# EAGLE design gps_tracker (EAGLE 7.4.0)

## Sheet 1 of 2
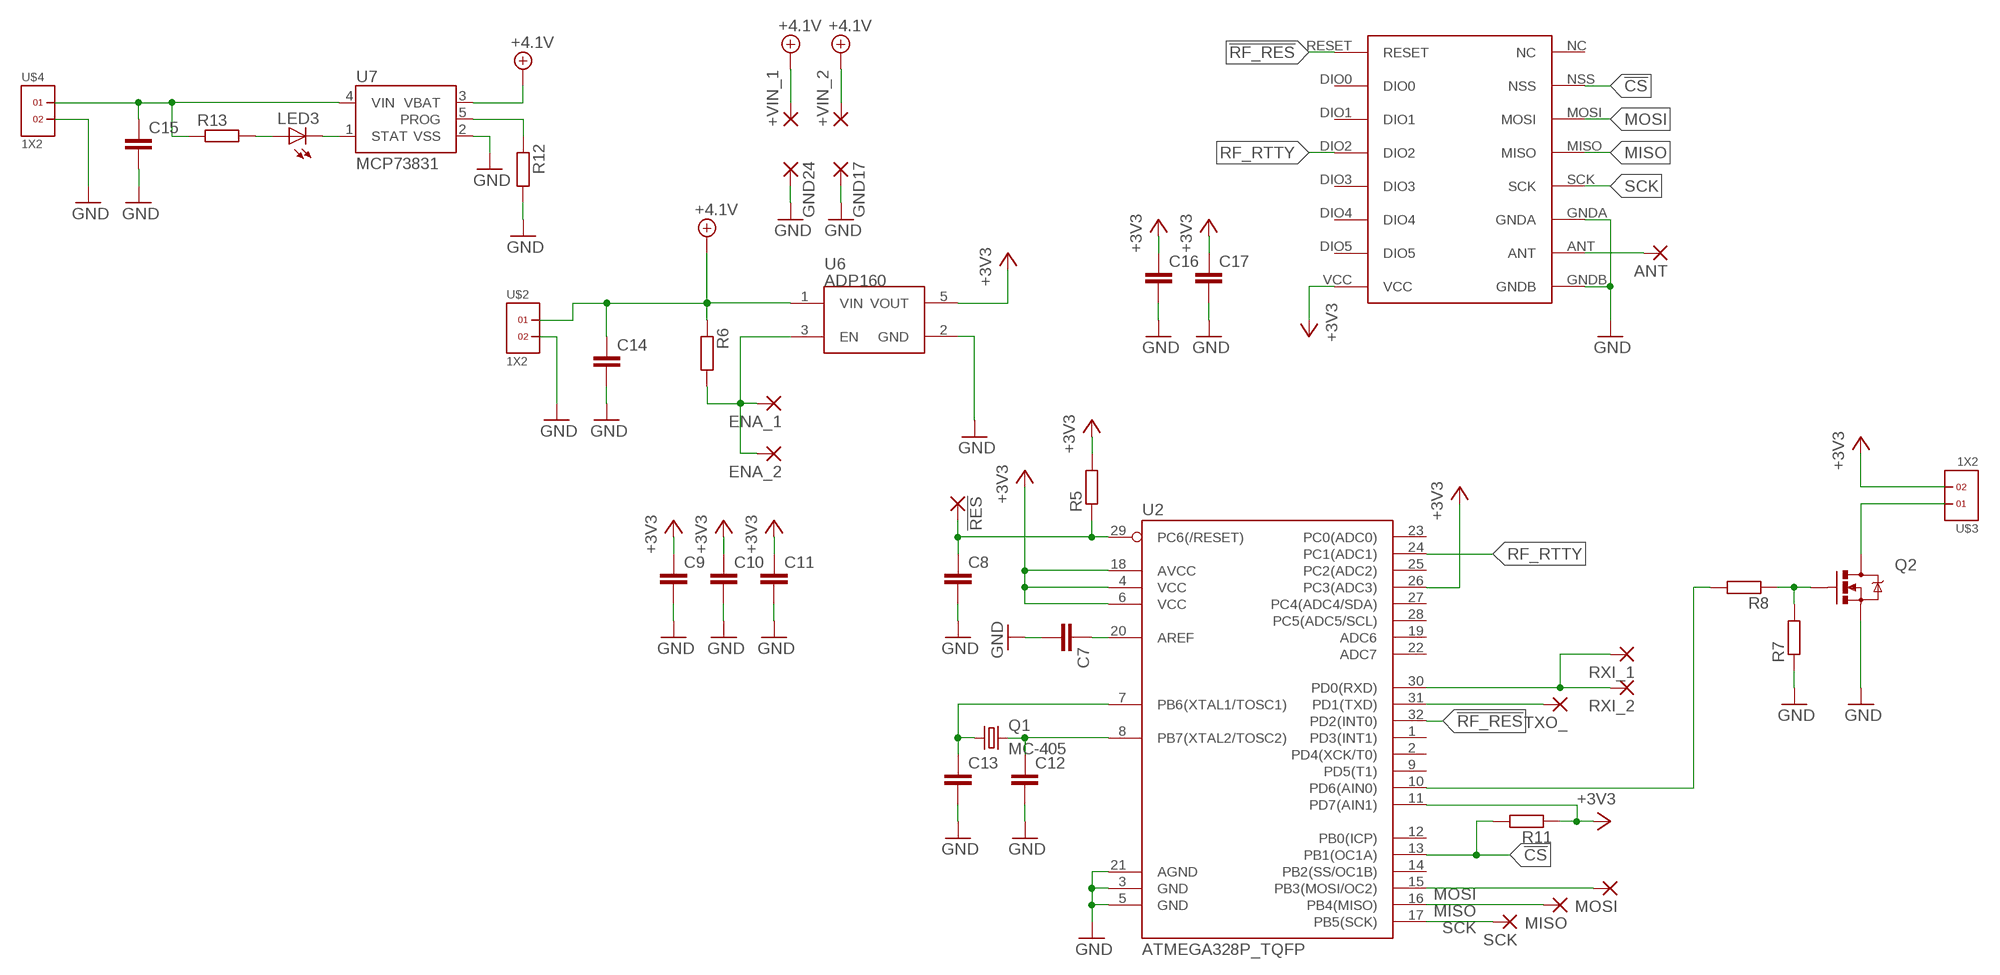
[diagram p0: schematic, sheet 1, part 1 of 2]
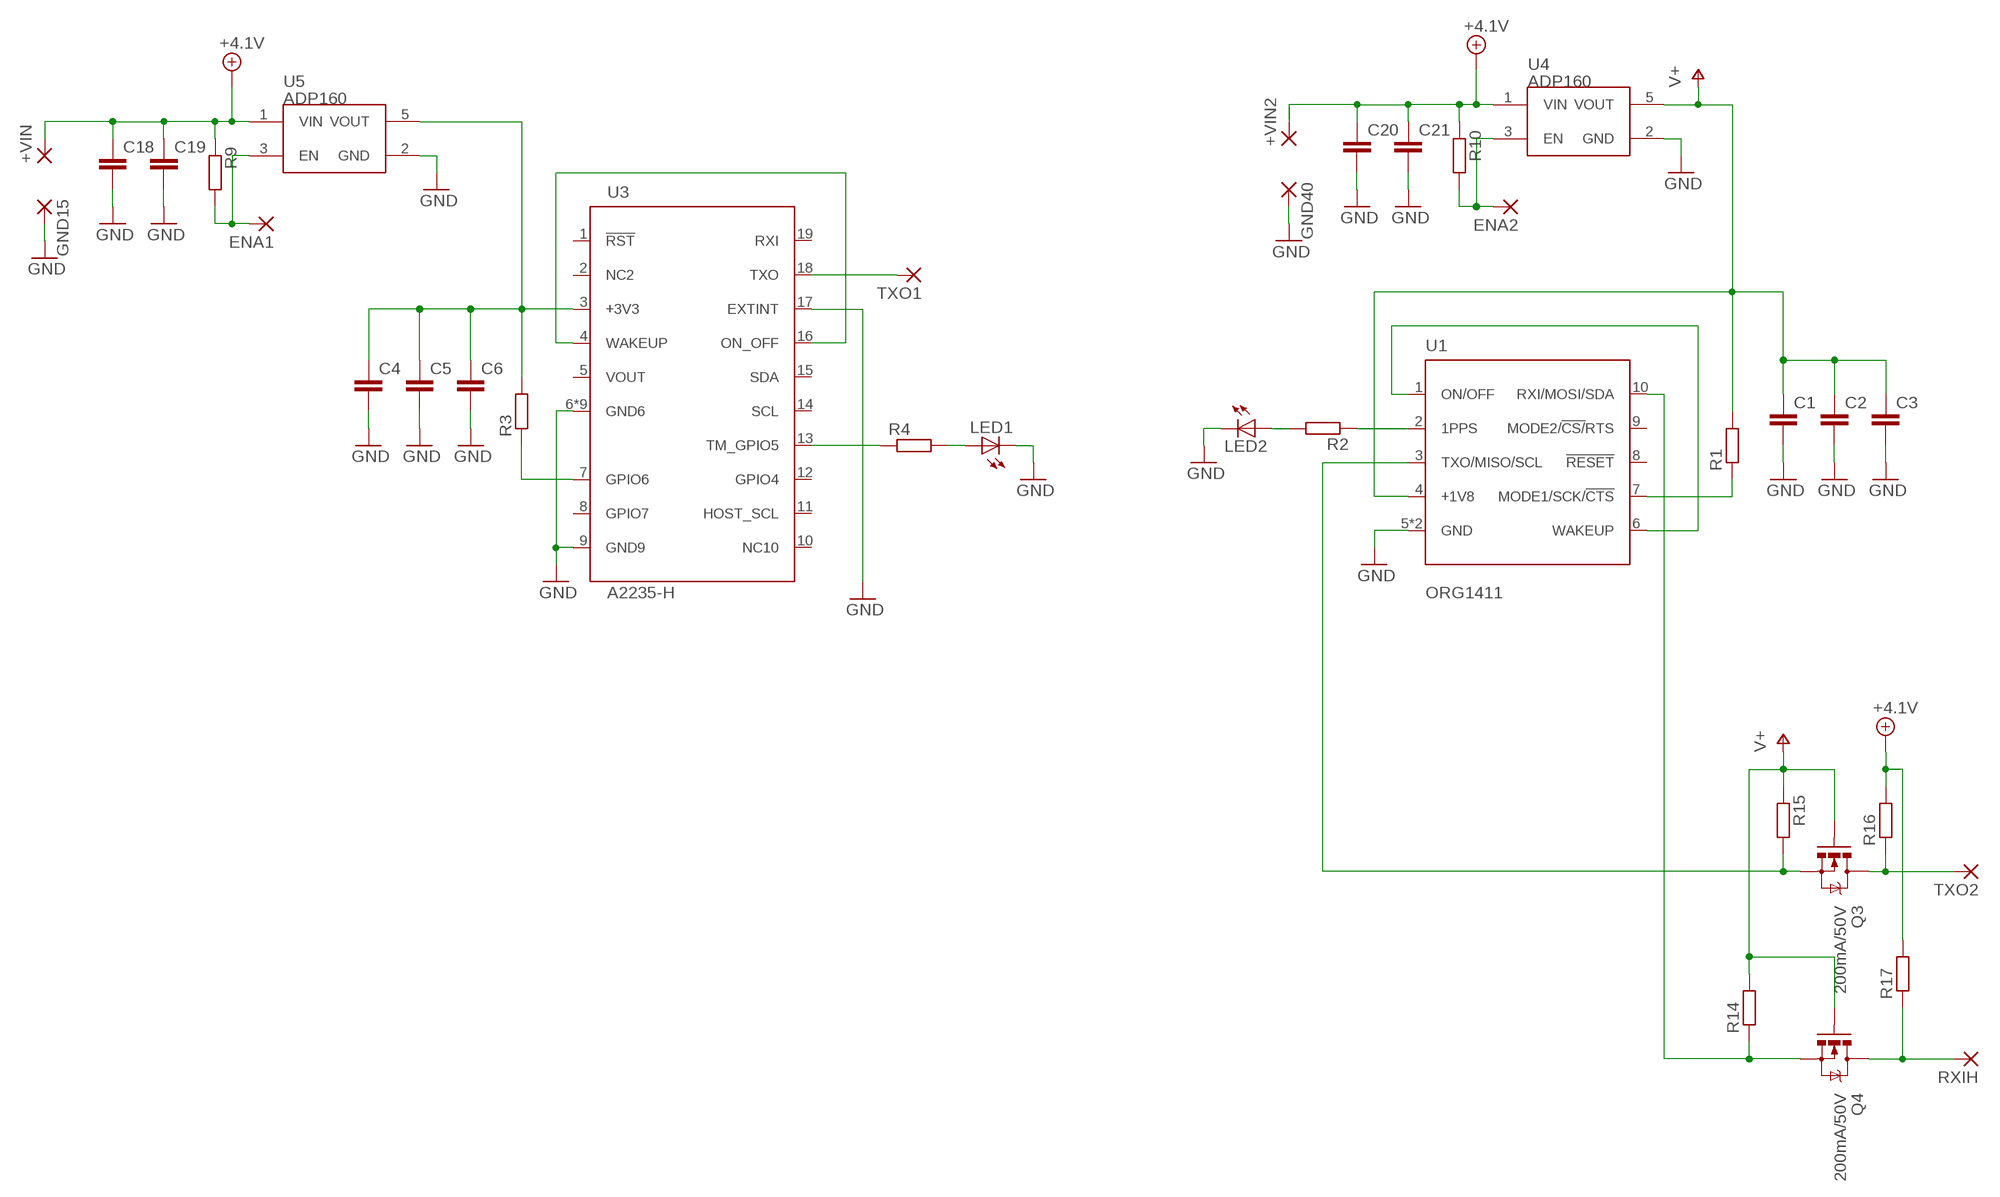
[diagram p1: schematic, sheet 1, part 2 of 2]

### Parts
!RES  SMD2  [SMD1,27-2,54]
+VIN  SMD2  [SMD1,27-2,54]
+VIN2  SMD2  [SMD1,27-2,54]
+VIN_1  SMD2  [SMD1,27-2,54]
+VIN_2  SMD2  [SMD1,27-2,54]
ANT  SMD2  [SMD1,27-2,54]
C1  C-EUC0603  [C0603]
C2  C-EUC0603  [C0603]
C3  C-EUC0603  [C0603]
C4  C-EUC0603  [C0603]
C5  C-EUC0603  [C0603]
C6  C-EUC0603  [C0603]
C7  C-EUC0603  [C0603]
C8  C-EUC0603  [C0603]
C9  C-EUC0603  [C0603]
C10  C-EUC0603  [C0603]
C11  C-EUC0603  [C0603]
C12  C-EUC0603  [C0603]
C13  C-EUC0603  [C0603]
C14  C-EUC0603  [C0603]
C15  C-EUC0603  [C0603]
C16  C-EUC0603  [C0603]
C17  C-EUC0603  [C0603]
C18  C-EUC0603  [C0603]
C19  C-EUC0603  [C0603]
C20  C-EUC0603  [C0603]
C21  C-EUC0603  [C0603]
ENA1  SMD2  [SMD1,27-2,54]
ENA2  SMD2  [SMD1,27-2,54]
ENA_1  SMD2  [SMD1,27-2,54]
ENA_2  SMD2  [SMD1,27-2,54]
GND15  SMD2  [SMD1,27-2,54]
GND17  SMD2  [SMD1,27-2,54]
GND24  SMD2  [SMD1,27-2,54]
GND40  SMD2  [SMD1,27-2,54]
LED1  LEDCHIPLED_0603  [CHIPLED_0603]
LED2  LEDCHIPLED_0603  [CHIPLED_0603]
LED3  LEDCHIPLED_0603  [CHIPLED_0603]
MISO  SMD2  [SMD1,27-2,54]
MOSI  SMD2  [SMD1,27-2,54]
Q1  MC-405  [MC-405]
Q2  MOSFET-NCHANNELAO3404A  [SOT23-3]
Q3  200mA/50V  MOSFET-NCHANNELBSS138  [SOT23-3]
Q4  200mA/50V  MOSFET-NCHANNELBSS138  [SOT23-3]
R1  R-EU_R0603  [R0603]
R2  R-EU_R0603  [R0603]
R3  R-EU_R0603  [R0603]
R4  R-EU_R0603  [R0603]
R5  R-EU_R0603  [R0603]
R6  R-EU_R0603  [R0603]
R7  R-EU_R0603  [R0603]
R8  R-EU_R0603  [R0603]
R9  R-EU_R0603  [R0603]
R10  R-EU_R0603  [R0603]
R11  R-EU_R0603  [R0603]
R12  R-EU_R0603  [R0603]
R13  R-EU_R0603  [R0603]
R14  R-EU_R0603  [R0603]
R15  R-EU_R0603  [R0603]
R16  R-EU_R1206  [R1206]
R17  R-EU_R1206  [R1206]
RXI_1  SMD2  [SMD1,27-2,54]
RXI_2  SMD2  [SMD1,27-2,54]
RXIH  SMD2  [SMD1,27-2,54]
SCK  SMD2  [SMD1,27-2,54]
TXO1  SMD2  [SMD1,27-2,54]
TXO2  SMD2  [SMD1,27-2,54]
TXO_  SMD2  [SMD1,27-2,54]
U1  ORG1411  [ORG1411]
U2  ATMEGA328P_TQFP  [TQFP32-08]
U3  A2235-H  [A2235-H]
U4  ADP160  [SOT23-5]
U5  ADP160  [SOT23-5]
U6  ADP160  [SOT23-5]
U7  MCP73831  [SOT23-5]
U$1  RFM69HW  [RFM]
U$2  1X2  [1X2]
U$3  1X2  [1X2]
U$4  1X2  [1X2]

### Nets
!CS: R11.2 U2.13(PB1(OC1A)) U$1.NSS
!RF_RES: U2.32(PD2(INT0)) U$1.RESET
+3V3: C9.1 C10.1 C11.1 C16.1 C17.1 R5.2 R11.1 U2.4(VCC) U2.6(VCC) U2.11(PD7(AIN1)) U2.18(AVCC) U2.26(PC3(ADC3)) U6.5(VOUT) U$1.VCC U$3.2
+4.1V: +VIN2.1(P) +VIN.1(P) +VIN_1.1(P) +VIN_2.1(P) C14.1 C18.1 C19.1 C20.1 C21.1 R6.1 R9.1 R10.1 R16.2 R17.2 U4.1(VIN) U5.1(VIN) U6.1(VIN) U7.3(VBAT) U$2.1
ENA: ENA_1.1(P) ENA_2.1(P) R6.2 U6.3(EN)
GND: C1.2 C2.2 C3.2 C4.2 C5.2 C6.2 C7.2 C8.2 C9.2 C10.2 C11.2 C12.2 C13.2 C14.2 C15.2 C16.2 C17.2 C18.2 C19.2 C20.2 C21.2 GND15.1(P) GND17.1(P) GND24.1(P) GND40.1(P) LED1.C LED2.C Q2.2(S) R7.1 R12.2 U1.5(GND) U1.11(GND) U2.3(GND) U2.5(GND) U2.21(AGND) U3.6(GND6) U3.9(GND9) U3.17(EXTINT) U3.101(GND6) U3.102(GND6) U3.103(GND6) U3.104(GND6) U3.105(GND6) U3.106(GND6) U3.107(GND6) U3.108(GND6) U4.2(GND) U5.2(GND) U6.2(GND) U7.2(VSS) U$1.GNDA U$1.GNDB U$2.2 U$4.2 ; also sheet 2
MISO: MISO.1(P) U2.16(PB4(MISO)) U$1.MISO
MOSI: MOSI.1(P) U2.15(PB3(MOSI/OC2)) U$1.MOSI
N$1: U1.1(ON/OFF) U1.6(WAKEUP)
N$2: R1.1 U1.7(MODE1/SCK/!CTS)
N$3: R2.1 U1.2(1PPS)
N$4: LED2.A R2.2
N$5: Q3.2(S) R15.2 U1.3(TXO/MISO/SCL)
N$6: R3.1 U3.7(GPIO6)
N$7: LED1.A R4.2
N$8: R4.1 U3.13(TM_GPIO5)
N$9: U3.4(WAKEUP) U3.16(ON_OFF)
N$10: TXO1.1(P) U3.18(TXO)
N$11: R12.1 U7.5(PROG)
N$12: C7.1 U2.20(AREF)
N$13: !RES.1(P) C8.1 R5.1 U2.29(PC6(/RESET))
N$14: ANT.1(P) U$1.ANT
N$15: C12.1 Q1.2 U2.8(PB7(XTAL2/TOSC2))
N$16: C13.1 Q1.1 U2.7(PB6(XTAL1/TOSC1))
N$17: TXO_.1(P) U2.31(PD1(TXD))
N$18: LED3.C U7.1(STAT)
N$19: Q2.1(G) R7.2 R8.1
N$20: R8.2 U2.10(PD6(AIN0))
N$21: Q2.3(D) U$3.1
N$22: LED3.A R13.2
N$23: ENA1.1(P) R9.2 U5.3(EN)
N$24: C15.1 R13.1 U7.4(VIN) U$4.1
N$25: ENA2.1(P) R10.2 U4.3(EN)
N$26: Q3.3(D) R16.1 TXO2.1(P)
N$27: C4.1 C5.1 C6.1 R3.2 U3.3(+3V3) U5.5(VOUT)
N$30: Q4.3(D) R17.1 RXIH.1(P)
N$32: Q4.2(S) R14.1 U1.10(RXI/MOSI/SDA)
RF_RTTY: U2.24(PC1(ADC1)) U$1.DIO2
RXI: RXI_1.1(P) RXI_2.1(P) U2.30(PD0(RXD))
SCK: SCK.1(P) U2.17(PB5(SCK)) U$1.SCK
V+: C1.1 C2.1 C3.1 Q3.1(G) Q4.1(G) R1.2 R14.2 R15.1 U1.4(+1V8) U4.5(VOUT)
Unconnected: U1.8(!RESET) U1.9(MODE2/!CS/!RTS) U2.1(PD3(INT1)) U2.2(PD4(XCK/T0)) U2.9(PD5(T1)) U2.12(PB0(ICP)) U2.14(PB2(SS/OC1B)) U2.19(ADC6) U2.22(ADC7) U2.23(PC0(ADC0)) U2.25(PC2(ADC2)) U2.27(PC4(ADC4/SDA)) U2.28(PC5(ADC5/SCL)) U3.1(!RST) U3.2(NC2) U3.8(GPIO7) U3.10(NC10) U3.11(HOST_SCL) U3.12(GPIO4) U3.14(SCL) U3.15(SDA) U3.19(RXI) U$1.DIO0 U$1.DIO1 U$1.DIO3 U$1.DIO4 U$1.DIO5 U$1.NC

## Sheet 2 of 2
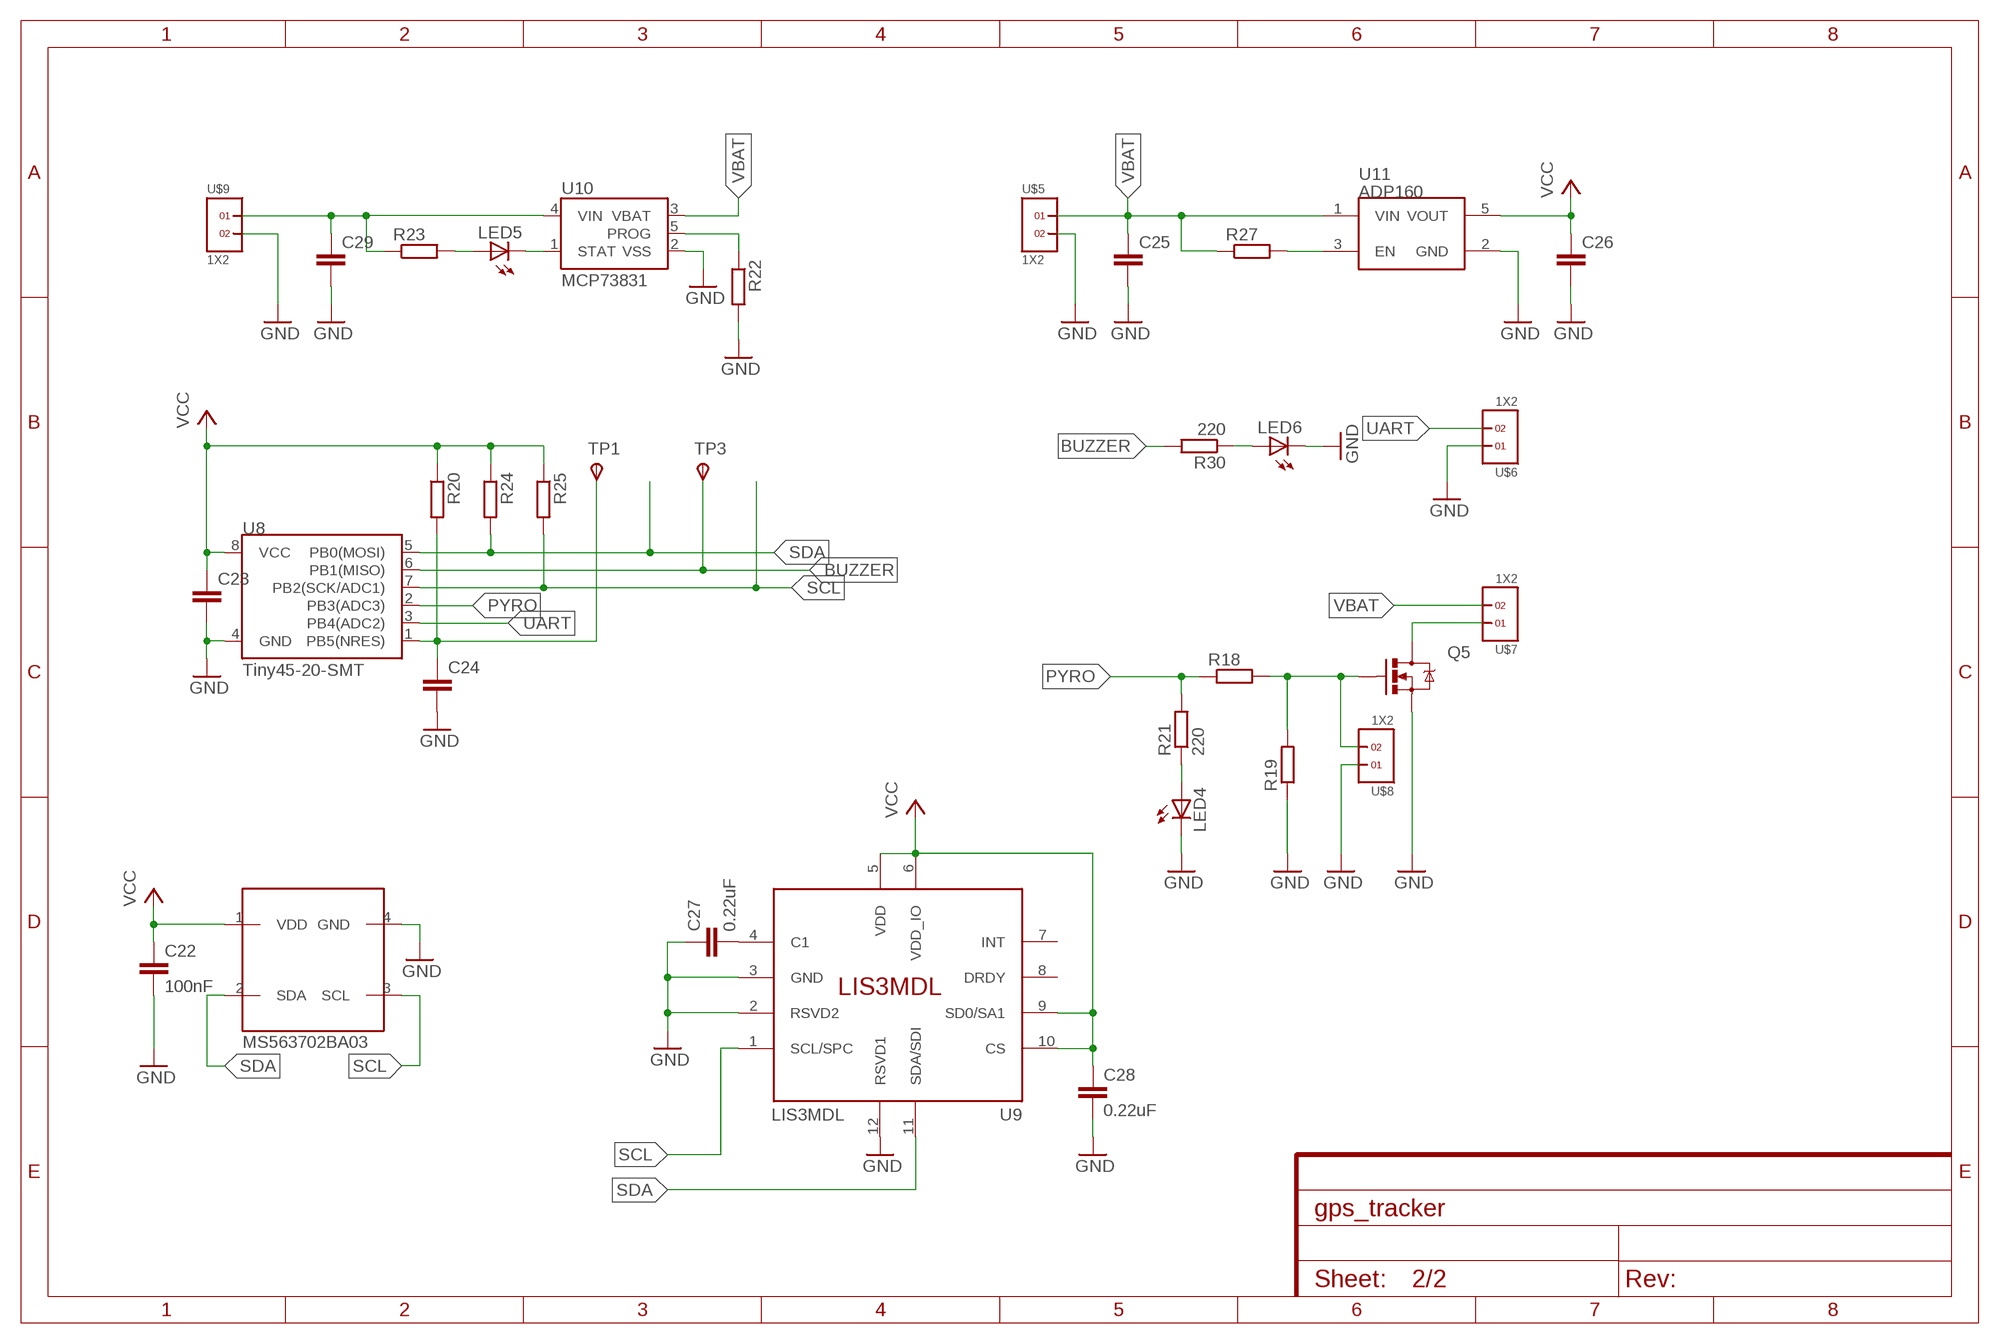
[diagram p2: schematic, sheet 2]

### Parts
C22  100nF  C-EUC0603  [C0603]
C23  C-EUC1206  [C1206]
C24  C-EUC0603  [C0603]
C25  C-EUC0603  [C0603]
C26  C-EUC0603  [C0603]
C27  0.22uF  C-EUC0603K  [C0603K]
C28  0.22uF  C-EUC0603  [C0603]
C29  C-EUC0603  [C0603]
IC1  MS563702BA03  [MS5637]
LED4  LEDCHIPLED_0805  [CHIPLED_0805]
LED5  LEDCHIPLED_0603  [CHIPLED_0603]
LED6  LEDCHIPLED_0805  [CHIPLED_0805]
Q5  MOSFET-NCHANNELBSS123LT1G  [SOT23-3]
R18  R-EU_R0603  [R0603]
R19  R-EU_R0603  [R0603]
R20  R-EU_R0603  [R0603]
R21  220  R-EU_R0603  [R0603]
R22  R-EU_R0603  [R0603]
R23  R-EU_R0603  [R0603]
R24  R-EU_R0603  [R0603]
R25  R-EU_R0603  [R0603]
R27  R-EU_R0603  [R0603]
R30  220  R-EU_R0603  [R0603]
TP1  TPSB1,27  [B1,27]
TP3  TPSB1,27  [B1,27]
U8  Tiny45-20-SMT  ATTINY45TINY45-20-SMT  [SO08-EIAJ]
U9  LIS3MDL  [VFLGA-12]
U10  MCP73831  [SOT23-5]
U11  ADP160  [SOT23-5]
U$5  1X2  [1X2]
U$6  1X2  [1X2]
U$7  1X2  [1X2]
U$8  1X2  [1X2]
U$9  1X2  [1X2]

### Nets
BUZZER: R30.2 TP3.TP(PP) U8.6(PB1(MISO))
GND: C22.2 C23.2 C24.2 C25.2 C26.2 C27.1 C28.2 C29.2 IC1.4(GND) LED4.C LED6.C Q5.2(S) R19.1 R22.2 U8.4(GND) U9.2(RSVD2) U9.3(GND) U9.12(RSVD1) U10.2(VSS) U11.2(GND) U$5.2 U$6.1 U$8.1 U$9.2 ; also sheet 1
N$28: Q5.3(D) U$7.1
N$29: C24.1 R20.2 TP1.TP(PP) U8.1(PB5(NRES))
N$31: Q5.1(G) R18.2 R19.2 U$8.2
N$33: LED4.A R21.1
N$34: R27.2 U11.3(EN)
N$35: LED6.A R30.1
N$36: C27.2 U9.4(C1)
N$37: R22.1 U10.5(PROG)
N$38: LED5.C U10.1(STAT)
N$39: LED5.A R23.2
N$40: C29.1 R23.1 U10.4(VIN) U$9.1
PYRO: R18.1 R21.2 U8.2(PB3(ADC3))
SCL: IC1.3(SCL) R25.2 U8.7(PB2(SCK/ADC1)) U9.1(SCL/SPC)
SDA: IC1.2(SDA) R24.2 U8.5(PB0(MOSI)) U9.11(SDA/SDI)
UART: U8.3(PB4(ADC2)) U$6.2
VBAT: C25.1 R27.1 U10.3(VBAT) U11.1(VIN) U$5.1 U$7.2
VCC: C22.1 C23.1 C26.1 C28.1 IC1.1(VDD) R20.1 R24.1 R25.1 U8.8(VCC) U9.5(VDD) U9.6(VDD_IO) U9.9(SD0/SA1) U9.10(CS) U11.5(VOUT)
Unconnected: U9.7(INT) U9.8(DRDY)

## Power pins joined to a net without a drawn wire
VOUT: U3.5(VOUT)

## Library data of the parts
!RES +VIN +VIN2 +VIN_1 +VIN_2 ANT ENA1 ENA2 ENA_1 ENA_2 GND15 GND17 GND24 GND40 MISO MOSI RXI_1 RXI_2 RXIH SCK TXO1 TXO2 TXO_ = wirepad:SMD2: SMD PAD
C1-C29 = rcl:C-EU: CAPACITOR, European symbol
IC1 = freetronics-original:MS5637
LED1-LED6 = led:LED: LED OSRAM: - CHIPLED LG R971, LG N971, LY N971, LG Q971, LY Q971, LO R971, LY R971 LH N974, LH R974 LS Q976, LO Q976, LY Q976 LO Q996 - Hyper CHIPLED LW Q18S LB Q993, LB Q99A, LB R99A - SideLED LS A670, LO A670, LY A670, LG A670, LP A670 LB A673, LV A673, LT A673, LW A673 LH A674 LY A675 LS A676, LA A676, LO A676, LY A676, LW A676 LS A679, LY A679, LG A679 - Hyper Micro SIDELED® LS Y876, LA Y876, LO Y876, LY Y876 LT Y87S - SmartLED LW L88C, LW L88S LB L89C, LB L89S, LG L890 LS L89K, LO L89K, LY L89K LS L896, LA L896, LO L896, LY L896 - TOPLED LS T670, LO T670, LY T670, LG T670, LP T670 LSG T670, LSP T670, LSY T670, LOP T670, LYG T670 LG T671, LOG T671, LSG T671 LB T673, LV T673, LT T673, LW T673 LH T674 LS T676, LA T676, LO T676, LY T676, LB T676, LH T676, LSB T676, LW T676 LB T67C, LV T67C, LT T67C, LS T67K, LO T67K, LY T67K, LW E67C LS E67B, LA E67B, LO E67B, LY E67B, LB E67C, LV E67C, LT E67C LW T67C LS T679, LY T679, LG T679 LS T770, LO T770, LY T770, LG T770, LP T770 LB T773, LV T773, LT T773, LW T773 LH T774 LS E675, LA E675, LY E675, LS T675 LS T776, LA T776, LO T776, LY T776, LB T776 LHGB T686 LT T68C, LB T68C - Hyper Mini TOPLED® LB M676 - Mini TOPLED Santana® LG M470 LS M47K, LO M47K, LY M47K Source: http://www.osram.convergy.de LUXEON: - LUMILED® LXK2-PW12-R00, LXK2-PW12-S00, LXK2-PW14-U00, LXK2-PW14-V00 LXK2-PM12-R00, LXK2-PM12-S00, LXK2-PM14-U00 LXK2-PE12-Q00, LXK2-PE12-R00, LXK2-PE12-S00, LXK2-PE14-T00, LXK2-PE14-U00 LXK2-PB12-K00, LXK2-PB12-L00, LXK2-PB12-M00, LXK2-PB14-N00, LXK2-PB14-P00, LXK2-PB14-Q00 LXK2-PR12-L00, LXK2-PR12-M00, LXK2-PR14-Q00, LXK2-PR14-R00 LXK2-PD12-Q00, LXK2-PD12-R00, LXK2-PD12-S00 LXK2-PH12-R00, LXK2-PH12-S00 LXK2-PL12-P00, LXK2-PL12-Q00, LXK2-PL12-R00 Source: www.luxeon.com KINGBRIGHT: KA-3528ASYC Source: www.kingbright.com
Q1 = gps_tracker:MC-405: kHz RANGE CRYSTAL UNIT SMD Source: MC-306_405_406_E07X.PDF Homepage <http://www.epsontoyocom.co.jp>; FARNELL: 2508596; OC_FARNELL: unknown; OC_NEWARK: unknown
Q2 = SparkFun-DiscreteSemi:MOSFET-NCHANNEL: Common NMOSFET Parts MFG P/N Store ID Prod ID FDD8780 TRANS-09984 SI7820DN TRANS-11055 FDS6630A IC-08089 2N7002PW TRANS-11151 FQP30N06L COM-10213 TRANS-10060 BSS123LT1G TRANS-08345 BSS138 TRANS-00830 BS170 2N7000; PROD_ID: TRAN-12988
Q3 Q4 = SparkFun-DiscreteSemi:MOSFET-NCHANNEL: Common NMOSFET Parts MFG P/N Store ID Prod ID FDD8780 TRANS-09984 SI7820DN TRANS-11055 FDS6630A IC-08089 2N7002PW TRANS-11151 FQP30N06L COM-10213 TRANS-10060 BSS123LT1G TRANS-08345 BSS138 TRANS-00830 BS170 2N7000; PROD_ID: TRANS-00830
Q5 = SparkFun-DiscreteSemi:MOSFET-NCHANNEL: Common NMOSFET Parts MFG P/N Store ID Prod ID FDD8780 TRANS-09984 SI7820DN TRANS-11055 FDS6630A IC-08089 2N7002PW TRANS-11151 FQP30N06L COM-10213 TRANS-10060 BSS123LT1G TRANS-08345 BSS138 TRANS-00830 BS170 2N7000; PROD_ID: TRANS-08345
R1-R20 R22-R25 R27 = rcl:R-EU_: RESISTOR, European symbol
R21 R30 = resistor:R-EU_: RESISTOR, European symbol
TP1 TP3 = testpad:TPS: TEST PIN
U1 = gps_tracker:ORG1411
U2 = SparkFun-DigitalIC:ATMEGA328P_TQFP; PROD_ID: IC-09069
U3 = gps_tracker:A2235-H
U4 = SparkFun-PowerIC:ADP160: Nanopower LDO Iq less than 1uA for low Iload; FARNELL: 2510505; PROD_ID: VREG-11306
U5 U6 U11 = SparkFun-PowerIC:ADP160: Nanopower LDO Iq less than 1uA for low Iload; FARNELL: 2510377; PROD_ID: VREG-11306
U7 U10 = SparkFun-PowerIC:MCP73831: Miniature single cell, fully integrated Li-Ion, Li-polymer charge management controller http://ww1.microchip.com/downloads/en/DeviceDoc/20001984g.pdf IC-09995; FARNELL: 1834892; PROD_ID: IC-09995
U8 = SparkFun-DigitalIC:ATTINY45: Atmel 8-pin 2/4/8kB flash uC; PROD_ID: IC-08922
U9 = kg-ic:LIS3MDL: Digital output magnetic sensor: ultra-low-power high-performance 3-axis magnetometer The LIS3MDL is an ultra-low-power high-performance three-axis Magnetic Sensor. It has user-selectable full scales of ±4/ ±8/ ±12/ ±16 gauss. The self-test capability allows the user to check the functioning of the sensor in the final application. The device may be configured to generate interrupt signals for magnetic field detection. It includes an I²C serial bus interface that supports standard and fast mode (100 and 400kHz) and SPI serial standard interface. Independent IO Supply (1.8V) ±4/±8/±12/±16 Gauss Selectable Magnetic Full Scale Continuous and Single-conversion Modes 16-bit Data Output Interrupt Generator Self-test I²C/SPI Digital Output Interface Power-down Mode/Low-power Mode
U$1 = hoperf:RFM69HW
U$2-U$9 = headers(2mm)(samtec):1X2

## Board
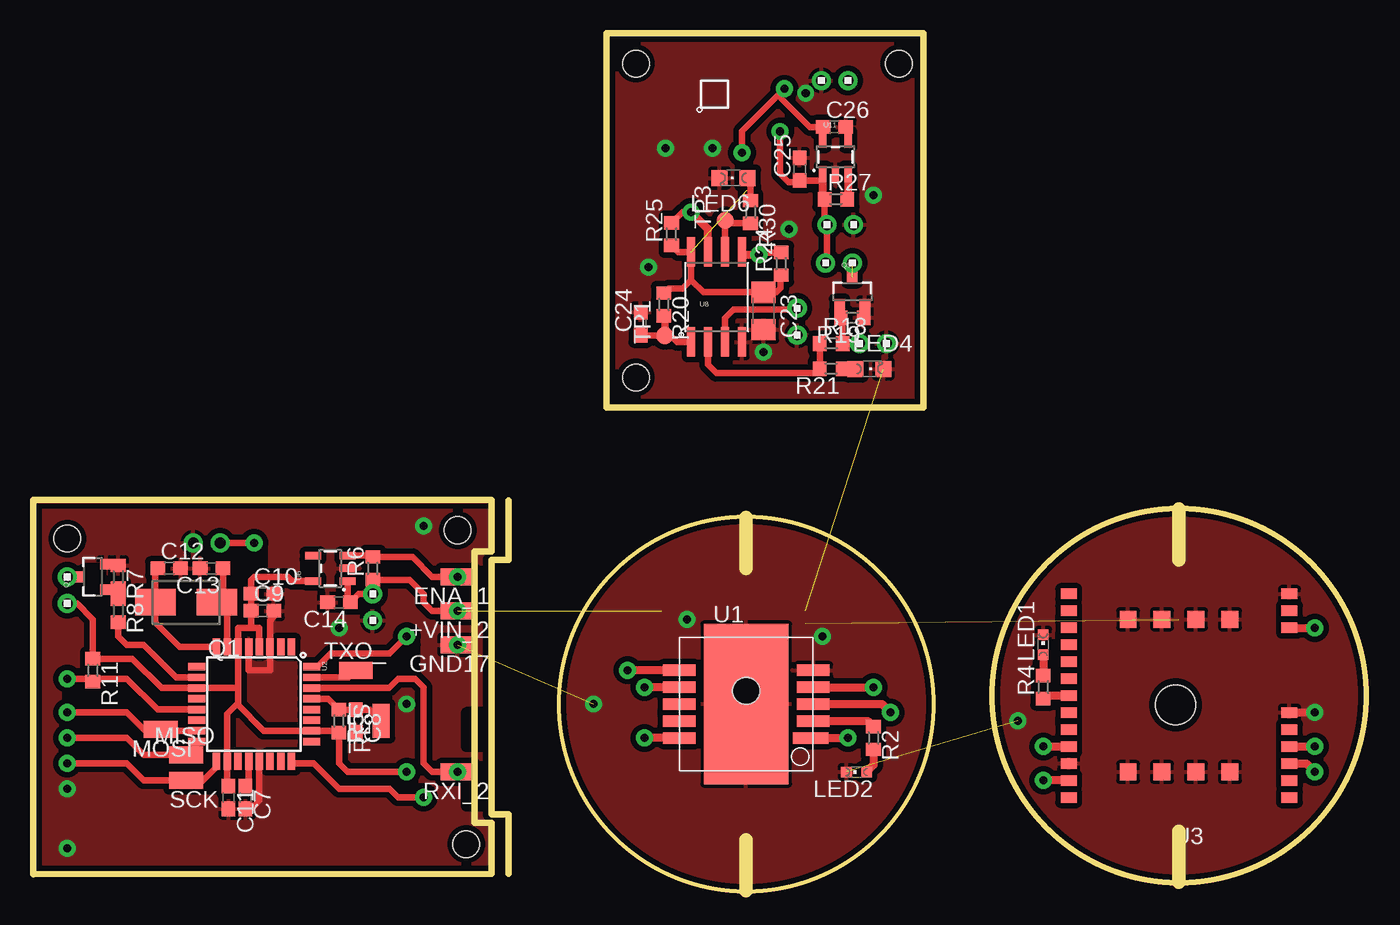
[diagram p3: board, top side]
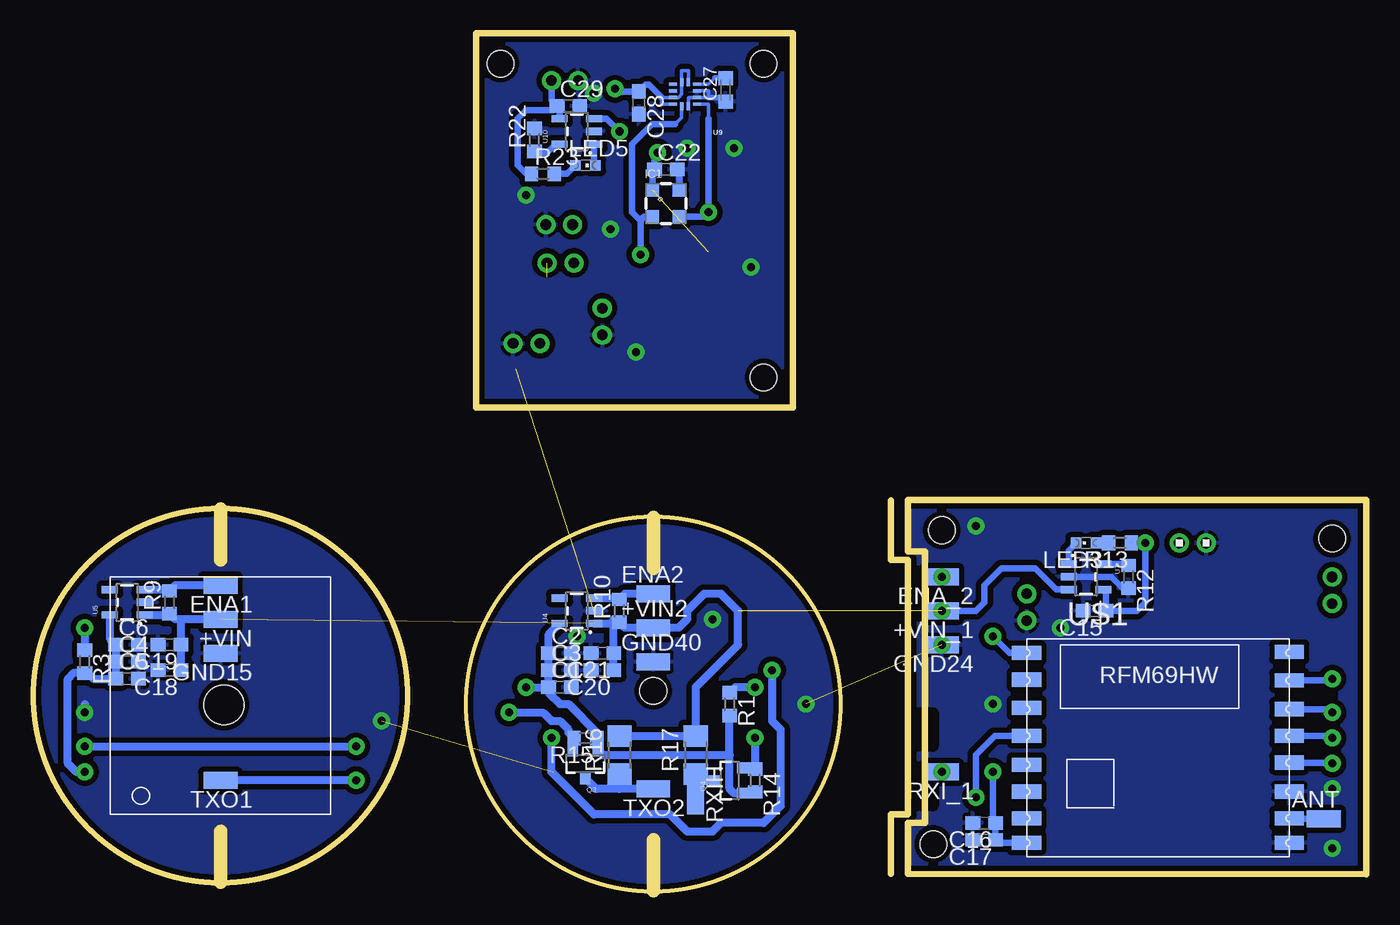
[diagram p4: board, bottom side, seen from below]

Size 99.72 x 64.2 mm. Coordinates in mm from the lower left corner, seen from the top.
Outline: 34.29,29.27 0,29.27 0,1.27 34.29,1.3
Outline: 35.56,1.3 35.56,5.75 34.29,5.75 34.29,24.8 35.56,24.8 35.56,29.24
Outline: 42.87,36.2 66.61,36.2 66.61,64.2 42.87,64.2 42.87,36.2
Outline: circle at 85.72,14.63 radius 14
Outline: circle at 53.34,14 radius 14
Copper layers (1*16): Top 0.035mm / dielectric 1.5mm / Bottom 0.035mm
Design rules "default *": minimum track width 10mil, minimum drill 24mil, track to track 8mil, track to pad 8mil, pad to pad 8mil, via to via 8mil, smd to smd 8mil, copper to edge 10mil, drill to drill 8mil, minimum pad ring 10mil, minimum via ring 8mil, stop-mask expansion 4mil, vias tented up to drill 0mil, thermal gap 10mil
Holes 2 mm at 2.54,26.38 32.39,3.52 45.09,38.45 45.09,61.94 64.77,61.94 31.75,27.02
tRestrict: area 32.4,6.4 to 33.7,7.6; area 32.4,10.8 to 33.7,12.1; area 30.5,21.6 to 31.1,22.9; area 2.5,14 to 3.2,15.3; area 27.3,16.5 to 28.6,18.4; area 3.8,23.5 to 5.1,24.2; area 10.2,22.3 to 12.7,22.9; area 12.7,25.4 to 13.3,26.1; area 20.3,23.5 to 21,24.8; area 12.7,7.6 to 14,8.3; area 16.5,24.2 to 17.1,25.4; area 32.4,12.1 to 33.7,13.4
bRestrict: area 84.5,21 to 85.7,22.3; area 52.1,21 to 52.7,22.3; area 32.4,6.4 to 33.7,7.6; area 32.4,10.8 to 33.7,12.1; area 30.5,21.6 to 31.1,22.9; area 2.5,14 to 3.2,15.3; area 32.4,12.1 to 33.7,13.4; area 51.1,50.2 to 53.7,52.7
Milling: 9 lines

### Footprints (pad centres in the part's own frame; a part is rotated, then mirrored left to right if it is on the bottom)
SMD1,27-2,54 = smd 1.27 x 2.54: 1 0,0
C0603 = smd 1.1 x 1: 1 -0.85,0; 2 0.85,0
C1206 = smd 1.6 x 1.8: 1 -1.4,0; 2 1.4,0
C0603K = smd 1.05 x 1.08: 1 -0.875,0; 2 0.875,0
MS5637 = smd 1 x 1: 1 -1,1; 2 -1,-1; 3 1,-1; 4 1,1
CHIPLED_0603 = smd 0.8 x 0.8: A 0,-0.75; C 0,0.75
CHIPLED_0805 = smd 1.2 x 1.2: A 0,-1.05; C 0,1.05
MC-405 = smd 3 x 2: 1 -2.3,0; 2 2.3,0
SOT23-3 = smd 0.8 x 0.9: 1 -0.95,-1; 2 0.95,-1; 3 0,1.1
R0603 = smd 1 x 1.1: 1 -0.85,0; 2 0.85,0
R1206 = smd 1.6 x 1.803: 1 -1.422,0; 2 1.422,0
B1,27 = smd 1.27 x 1.27: TP 0,0
ORG1411 = smd 2.676 x 0.864: 1 4.818,-2.54 | smd 2.422 x 0.864: 2 5.025,-1.27; 3 5.025,0; 4 5.025,1.27; 5 5.025,2.54; 6 -5.025,2.54; 7 -5.025,1.27; 8 -5.025,0; 9 -5.025,-1.27; 10 -5.025,-2.54 | smd 6.35 x 12: 11 0,0 | hole 2: 0,1
TQFP32-08 = smd 1.27 x 0.559: 1 -4.293,2.8; 2 -4.293,2; 3 -4.293,1.2; 4 -4.293,0.4; 5 -4.293,-0.4; 6 -4.293,-1.2; 7 -4.293,-2; 8 -4.293,-2.8; 17 4.293,-2.8; 18 4.293,-2; 19 4.293,-1.2; 20 4.293,-0.4; 21 4.293,0.4; 22 4.293,1.2; 23 4.293,2; 24 4.293,2.8 | smd 0.559 x 1.27: 9 -2.8,-4.293; 10 -2,-4.293; 11 -1.2,-4.293; 12 -0.4,-4.293; 13 0.4,-4.293; 14 1.2,-4.293; 15 2,-4.293; 16 2.8,-4.293; 25 2.8,4.293; 26 2,4.293; 27 1.2,4.293; 28 0.4,4.293; 29 -0.4,4.293; 30 -1.2,4.293; 31 -2,4.293; 32 -2.8,4.293
A2235-H = smd 1.2 x 0.8: 1 -8.255,7.62; 2 -8.255,6.35; 3 -8.255,5.08; 4 -8.255,3.81; 5 -8.255,2.54; 6 -8.255,1.27; 7 -8.255,-5.08; 8 -8.255,-6.35; 9 -8.255,-7.62; 10 8.255,-3.81; 11 8.255,-2.54; 12 8.255,-1.27; 13 8.255,0; 14 8.255,1.27; 15 8.255,2.54; 16 8.255,3.81; 17 8.255,5.08; 18 8.255,6.35; 19 8.255,7.62; 201 8.255,-5.08; 202 8.255,-6.35; 203 8.255,-7.62 | smd 1.27 x 1.27: 101 1.27,-5.715; 102 -3.81,-5.715; 103 -3.81,5.715; 104 -1.27,-5.715; 105 -1.27,5.715; 106 3.81,-5.715; 107 3.81,5.715; 108 1.27,5.715 | hole 3: 0.255,0.69
SOT23-5 = smd 0.55 x 1.2: 1 -0.95,-1.3; 2 0,-1.3; 3 0.95,-1.3; 4 0.95,1.3; 5 -0.95,1.3
SO08-EIAJ = smd 0.61 x 2.21: 1 -1.905,-3.378; 2 -0.635,-3.378; 3 0.635,-3.378; 4 1.905,-3.378; 5 1.905,3.353; 6 0.635,3.353; 7 -0.635,3.353; 8 -1.905,3.353
VFLGA-12 = smd 0.6 x 0.25: 1 -0.9,0.75; 2 -0.9,0.25; 3 -0.9,-0.25; 4 -0.9,-0.75; 7 0.9,-0.75; 8 0.9,-0.25; 9 0.9,0.25; 10 0.9,0.75 | smd 0.25 x 0.6: 5 -0.25,-0.9; 6 0.25,-0.9; 11 0.25,0.9; 12 -0.25,0.9
RFM = smd 2.184 x 1.067: ANT 9.491,-4.731; DIO0 -10.16,5.65; DIO1 -10.16,3.522; DIO2 -10.16,1.427; DIO3 -10.16,-0.731; DIO4 -10.16,-2.731; DIO5 -10.16,-4.731; GNDA 9.491,-2.731; GNDB 9.491,-6.572; MISO 9.491,1.427; MOSI 9.491,3.428; NC 9.491,7.714; NSS 9.491,5.586; RESET -10.16,7.65; SCK 9.491,-0.573; VCC -10.16,-6.572
1X2 = drill 0.8 pad 1.422: 1 0,0; 2 2,0

### Placement (x,y rotation side)
!RES  26.04,12.73 0 top
+VIN  85.72,20.35 90 bottom
+VIN2  53.34,19.71 270 bottom
+VIN_1  31.75,20.98 90 bottom
+VIN_2  31.75,20.98 90 top
ANT  3.18,5.43 270 bottom
C1  60.33,15.27 0 bottom
C2  60.33,17.81 0 bottom
C3  60.33,16.54 0 bottom
C4  92.71,17.17 0 bottom
C5  92.71,15.9 0 bottom
C6  92.71,18.45 0 bottom
C7  15.88,7.01 270 top
C8  24.13,12.73 270 top
C9  17.14,20.98 0 top
C10  17.14,22.26 0 top
C11  14.6,7.01 270 top
C12  10.16,24.16 0 top
C13  13.33,24.16 180 top
C14  22.86,21.62 180 top
C15  20.32,20.98 180 bottom
C16  28.57,5.11 180 bottom
C17  28.57,3.84 180 bottom
C18  89.53,16.54 180 bottom
C19  89.53,18.45 180 bottom
C20  57.15,16.54 180 bottom
C21  57.15,17.81 180 bottom
C22  52.39,54.01 0 bottom
C23  54.63,43.43 270 top
C24  45.44,42.48 90 top
C25  57.34,54.04 90 top
C26  59.94,57.19 0 top
C27  47.93,59.96 90 bottom
C28  54.42,58.99 270 bottom
C29  59.69,58.77 0 bottom
ENA1  85.72,22.89 90 bottom
ENA2  53.34,22.26 270 bottom
ENA_1  31.75,23.52 90 top
ENA_2  31.75,23.52 90 bottom
GND15  85.72,17.81 90 bottom
GND17  31.75,18.45 90 top
GND24  31.75,18.45 90 bottom
GND40  53.34,17.17 270 bottom
IC1  52.39,51.47 0 bottom
LED1  75.56,18.45 0 top
LED2  61.6,8.92 90 top
LED3  20.95,26.06 90 bottom
LED4  62.56,39.09 270 top
LED5  58.42,54.32 270 bottom
LED6  52.39,53.37 90 top
MISO  11.43,10.19 270 top
MOSI  9.53,12.09 90 top
Q1  11.43,21.62 180 top
Q2  4.45,23.52 90 top
Q3  58.42,9.55 180 bottom
Q4  47.62,8.29 90 bottom
Q5  61.28,44.86 0 top
R1  47.62,14 270 bottom
R2  62.87,11.46 270 top
R3  95.88,17.17 270 bottom
R4  75.56,15.27 90 top
R5  22.86,12.73 270 top
R6  25.4,24.16 90 top
R7  6.35,23.52 270 top
R8  6.35,20.98 270 top
R9  89.53,21.62 90 bottom
R10  55.88,20.98 90 bottom
R11  4.45,16.54 270 top
R12  17.78,23.52 270 bottom
R13  18.41,26.06 180 bottom
R14  45.72,8.29 270 bottom
R15  58.42,11.46 180 bottom
R16  55.88,10.19 90 bottom
R17  50.16,10.19 90 bottom
R18  59.7,40.99 0 top
R19  61.28,42.92 180 top
R20  47.18,43.91 270 top
R21  59.7,39.1 180 top
R22  62.23,56.23 90 bottom
R23  61.6,53.69 0 bottom
R24  55.96,46.95 90 top
R25  47.74,49.18 90 top
R27  60.06,51.78 0 top
R30  53.66,50.83 270 top
RXI_1  31.75,8.92 90 bottom
RXI_2  31.75,8.92 90 top
RXIH  50.16,7.01 180 bottom
SCK  11.43,8.29 90 top
TP1  47.23,41.58 90 top
TP3  51.76,50.2 90 top
TXO1  85.72,8.29 90 bottom
TXO2  53.34,7.65 90 bottom
TXO_  24.13,16.54 270 top
U1  53.34,14 0 top
U2  16.51,14 270 top
U3  85.72,14.63 180 top
U4  59.05,20.98 90 bottom
U5  92.71,21.62 90 bottom
U6  22.22,24.16 90 top
U7  20.95,23.52 270 bottom
U8  51.12,44.48 0 top
U9  50.97,59.65 180 bottom
U10  59.06,56.86 90 bottom
U11  60.01,54.96 0 top
U$1  15.24,10.19 0 bottom
U$2  25.4,22.26 270 top
U$3  2.54,23.52 270 top
U$4  13.97,26.06 0 bottom
U$5  59.38,49.88 0 top
U$6  57.16,41.63 90 top
U$7  61.29,47.02 180 top
U$8  63.83,40.99 180 top
U$9  60.96,60.67 180 top

### Tracks (layer width: path | path; a pad name or v marks a point on that pad's centre or on a via)
!CS  (via drill 0.6 pad 1.27)
  Top 0.5: U2.13 9.29,13.6 6.99,15.91 4.66,15.91 R11.2 4.45,15.91 v2.54,15.91
  Bottom 0.5: U$1.NSS 2.67,15.78 v2.54,15.91
!RF_RES  (via drill 0.6 pad 1.27)
  Top 0.5: v27.94,19.08 26.67,17.81 22.23,17.81 21.22,16.8 U2.32
  Bottom 0.5: 27.91,19.11 v27.94,19.08 26.7,17.84 U$1.RESET
+3V3  (via drill 0.6 pad 1.27)
  Top 0.5: 15.31,15.27 U2.6 15.31,19.72 16.3,19.72 | 15.31,15.27 15.31,14.07 15.24,14 | 15.24,14 14.51,13.27 U2.18 14.51,7.96 C11.1 | 16.3,19.72 16.91,19.72 U2.4 | 16.3,19.72 C9.1 C10.1 16.3,23.31 16.51,23.53 19.05,23.53 19.37,23.21 U6.5 | 15.24,14 17.24,12 U2.26 22.74,12 R5.2 22.86,9.56 23.5,8.92 v27.94,8.92 | 15.31,15.27 15.24,15.2 U2.11 9.6,15.2 7.41,17.39 R11.1 4.45,20.35 3.27,21.53 U$3.2
  Bottom 0.5: v27.94,8.92 27.94,5.33 C16.1 C17.1 27.5,3.62 U$1.VCC
+4.1V  (via drill 0.6 pad 1.27)  (2 unrouted)
  Top 0.5: U6.1 23.53,21.81 C14.1 24.35,22.26 U$2.1 R6.1 28.16,23.31 29.21,22.26 29.21,21.62 29.85,20.99 +VIN_2.1
  Bottom 0.5: U7.3 23.18,22.58 24.77,24.16 27.31,24.16 28.58,22.89 28.58,21.62 29.21,20.99 +VIN_2.1
  Bottom 0.61: U5.1 89.64,20.67 R9.1 89.12,20.35 88.9,20.35 | +VIN.1 88.9,20.35 | 88.9,20.35 88.69,20.14 C19.1 C18.1 | R10.1 55.46,19.72 +VIN2.1 51.44,19.72 50.8,20.35 50.8,20.99 49.53,22.26 48.26,22.26 46.99,20.99 46.99,18.45 50.17,15.27 R17.2 R16.2 | U4.1 55.98,20.04 R10.1 | C20.1 C21.1 56.3,20.35 R10.1
  other vias: 31.75,20.98
BUZZER
  Top 0.5: U8.6 TP3.TP 51.97,49.98 R30.2
ENA  (via drill 0.6 pad 1.27)
  Top 0.5: U6.3 25.3,25.11 R6.2 28.36,25.01 29.85,23.53 ENA_2.1
  other vias: 31.75,23.52
GND  (via drill 0.6 pad 1.27)  (3 unrouted)
  Top 0.5: U2.5 16.11,16.54 17.71,16.54 U2.3 17.71,20.28 18,20.57 C9.2 | U2.21 16.91,6.78 16.51,6.38 16.09,6.38 C7.2 | Q2.2 6.25,24.48 R7.1
  Top 0.61: U3.6 v95.89,13.37
  Bottom 0.25: U9.3 49.22,59.9 49.22,59.4 U9.2 50.72,59.4 U9.12
  Bottom 0.406: 49.22,59.4 48.25,59.4 C27.1
  Bottom 0.5: R12.2 18.2,22.68 19.05,23.53 U7.2 | IC1.4 51.39,53.86 C22.2
  Bottom 0.61: v95.89,13.37 95.89,14
  other vias: 2.54,3.2 2.54,7.65 73.66,12.73 41.91,14 59.05,19.08 27.94,14 29.21,27.34 31.75,18.45 22.86,19.71 48.9,20.35 54.62,40.36 46.04,46.71 50.81,55.6 47.31,55.6 56.52,49.56 62.87,52.1 57.79,59.72
  pour Bottom (isolate 0.406): 92.07,29.88 78.1,29.88 70.48,22.26 70.48,8.29 79.38,-0.61 92.07,-0.61 100.96,8.29 100.96,20.98
  pour Bottom (isolate 0.406): 45.72,-1.88 60.96,-1.24 68.58,6.38 68.58,20.35 59.69,29.24 46.99,29.24 38.1,20.35 38.1,7.65
  pour Top (isolate 0.406): 45.72,-1.88 60.96,-1.24 68.58,6.38 68.58,20.35 59.69,29.24 46.99,29.24 38.1,20.35 38.1,7.65
  pour Top (isolate 0.406): 92.07,29.88 78.1,29.88 70.48,22.26 70.48,8.29 79.38,-0.61 92.07,-0.61 100.96,8.29 100.96,20.98
  pour Top (isolate 0.406): 34.29,0.03 34.29,30.51 -1.27,30.51 -1.27,0.03
  pour Bottom (isolate 0.406): 34.29,0.03 34.29,30.51 -1.27,30.51 -1.27,0.03
  pour Top (isolate 0.406): 41.92,65.41 67.72,65.41 67.72,34.59 41.92,34.59
  pour Bottom (isolate 0.406): 40.97,33.37 68.59,33.05 68.59,66.71 40.33,66.39
MISO  (via drill 0.6 pad 1.27)
  Top 0.5: U2.16 12.22,10.98 MISO.1 8.26,10.19 6.99,11.46 v2.54,11.46
  Bottom 0.5: U$1.MISO 2.7,11.62 v2.54,11.46
MOSI  (via drill 0.6 pad 1.27)
  Top 0.5: U2.15 9.62,12 MOSI.1 8.26,12.1 6.99,13.37 v2.54,13.37
  Bottom 0.5: U$1.MOSI 2.79,13.62 v2.54,13.37
N$1  (via drill 0.6 pad 1.27)
  Top 0.61: U1.1 v60.96,11.46 | U1.6 v44.45,16.54
  Bottom 0.61: v44.45,16.54 44.45,12.73 43.82,12.1 43.82,6.38 45.09,5.11 48.26,5.11 48.9,4.48 50.8,4.48 52.07,5.75 57.79,5.75 60.96,8.92 v60.96,11.46
N$2  (via drill 0.6 pad 1.27)
  Top 0.61: U1.7 v45.72,15.27
  Bottom 0.61: v45.72,15.27 47.21,15.27 R1.1
N$3
  Top 0.61: U1.2 62.45,12.73 R2.1
N$4
  Top 0.61: R2.2 62.87,9.44 LED2.A
N$5  (via drill 0.6 pad 1.27)
  Top 0.61: U1.3 63.5,14 v64.14,13.37
  Bottom 0.61: v64.14,13.37 61.6,13.37 60.96,12.73 60.33,12.73 59.69,12.1 59.69,11.88 R15.2 59.27,10.66 Q3.2
N$6  (via drill 0.6 pad 1.27)
  Top 0.61: U3.7 v95.89,19.72
  Bottom 0.61: v95.89,19.72 R3.1
N$7
  Top 0.61: LED1.A R4.2
N$8
  Top 0.61: U3.13 75.78,14.64 R4.1
N$9  (via drill 0.6 pad 1.27)
  Top 0.61: U3.4 v95.89,10.83 | v75.57,10.83 U3.16
  Bottom 0.61: v95.89,10.83 v75.57,10.83
N$10  (via drill 0.6 pad 1.27)
  Top 0.61: U3.18 v75.57,8.29
  Bottom 0.61: v75.57,8.29 TXO1.1
N$11
  Bottom 0.5: U7.5 17.88,24.48 R12.1
N$12
  Top 0.5: U2.20 16.11,8.1 C7.1
N$13
  Top 0.5: U2.29 22.04,14.4 R5.1 C8.1 25.19,13.58 !RES.1
N$14
  Bottom 0.5: ANT.1 5.72,5.43 U$1.ANT
N$15
  Top 0.5: U2.8 10.95,18.29 9.13,20.11 Q1.2 9.13,23.98 C12.1
N$16
  Top 0.5: U2.7 14.51,20.84 Q1.1 14.19,22.08 C13.1
N$17
  Top 0.5: U2.31 23.59,16 TXO_.1
N$18
  Bottom 0.5: U7.1 22.26,25.52 LED3.C
N$19
  Top 0.5: Q2.1 6.25,22.58 R7.2 R8.1
N$20
  Top 0.5: U2.10 10.7,16 8.26,18.45 6.99,18.45 6.35,19.08 R8.2
N$21
  Top 0.5: U$3.1 Q2.3
N$22
  Bottom 0.5: LED3.A R13.2
N$23
  Bottom 0.61: U5.3 89.64,22.57 R9.2 89.12,22.89 ENA1.1
N$24  (via drill 0.6 pad 1.27)
  Top 0.5: U$4.1 v16.51,26.07
  Bottom 0.5: U7.4 19.47,22.39 C15.1 17.15,20.99 16.51,21.62 v16.51,26.07 R13.1
N$25
  Bottom 0.61: U4.3 55.98,21.94 R10.2 55.46,22.26 ENA2.1
N$26
  Bottom 0.61: TXO2.1 55.88,7.65 | 55.88,7.65 57.62,7.65 Q3.3 | R16.1 55.88,7.65
N$27  (via drill 0.6 pad 1.27)
  Top 0.61: U3.3 95.25,9.56 v95.89,8.92
  Bottom 0.61: U5.5 94.01,18.9 C6.1 C4.1 C5.1 95.25,15.91 95.67,16.33 R3.2 96.74,16.33 97.16,15.91 97.16,9.56 96.52,8.92 v95.89,8.92
N$28  (1 unrouted)
N$29
  Top 0.5: U8.1 48.15,41.1 47.31,41.94 47.31,42.58 | 47.31,42.58 47.31,42.93 R20.2 | 47.31,42.58 47.23,42.5 TP1.TP 45.48,41.58 C24.1
N$30
  Bottom 0.61: Q4.3 49.68,8.29 R17.1 RXIH.1
N$31
  Top 0.5: U$8.2 R18.2 60.55,42.8 R19.2
  Top 0.61: Q5.1 60.33,43.02 R19.2
N$32  (via drill 0.6 pad 1.27)
  Top 0.61: U1.10 v45.72,11.46
  Bottom 0.61: v45.72,11.46 R14.1 45.82,9.24 Q4.2
N$33
  Top 0.5: R21.1 61.5,39.1 LED4.A
N$34
  Top 0.61: U11.3 60.96,51.83 R27.2
N$35
  Top 0.5: R30.1 53.66,53.15 LED6.A
N$36
  Bottom 0.25: U9.4 49.22,60.4 48.72,60.9
  Bottom 0.406: 48.72,60.9 48,60.9 C27.2
N$37
  Bottom 0.5: U10.5 60.64,55.91 61.28,55.28 62.13,55.28 R22.1
N$38
  Bottom 0.5: U10.1 57.76,54.41 LED5.C
N$39
  Bottom 0.5: R23.2 59.81,53.69 LED5.A
N$40
  Bottom 0.5: U10.4 60.36,58.58 C29.1 | R23.1 62.87,53.69 63.5,54.32 63.5,57.82 62.87,58.45 60.86,58.45 C29.1 | U$9.1 60.96,59.19 C29.1
PYRO
  Top 0.5: 58.75,39 R21.2 | R21.2 R18.1 | U8.2 50.49,39.41 51.12,38.77 58.52,38.77 R21.2
RF_RTTY  (via drill 0.6 pad 1.27)
  Top 0.5: v29.21,7.02 27.31,7.02 26.67,7.65 22.86,7.65 20.96,9.56 19.46,9.56 U2.24
  Bottom 0.5: U$1.DIO2 27.78,11.62 29.21,10.19 v29.21,7.02
RXI  (via drill 0.6 pad 1.27)
  Top 0.5: U2.30 26.6,15.2 27.31,15.91 28.58,15.91 29.21,15.27 29.21,9.56 29.85,8.92 RXI_1.1
  other vias: 31.75,8.92
SCK  (via drill 0.6 pad 1.27)
  Top 0.5: U2.17 13.71,9.3 12.7,8.29 SCK.1 8.26,8.29 6.99,9.56 v2.54,9.56
  Bottom 0.5: U$1.SCK 2.6,9.62 v2.54,9.56
SCL  (via drill 0.6 pad 1.27)
  Top 0.5: R25.2 47.78,50.03 48.58,50.83 v49.22,50.83
  Top 0.61: U8.7 50.49,49.56 v49.22,50.83
  Bottom 0.25: U9.1 49.22,58.9 49.22,57.82
  Bottom 0.5: IC1.3 49.58,50.47 v49.22,50.83 49.22,57.82
SDA  (via drill 0.6 pad 1.27)
  Top 0.3: 53.14,47.66 U8.5
  Top 0.5: R24.2 54.45,47.81 v54.3,47.66
  Top 0.61: 53.14,47.66 v54.3,47.66
  Bottom 0.25: U9.11 51.22,57.9 51.72,57.4
  Bottom 0.5: IC1.2 54.03,50.47 54.3,50.2 | 54.3,50.2 v54.3,47.66 | 51.72,57.4 53.45,57.4 54.93,55.91 54.93,50.83 54.3,50.2
UART
  Top 0.5: U8.3 51.76,42.9 52.08,43.21 | 52.08,43.21 | 52.08,43.21 52.39,43.53 56.74,43.53 U$6.2
V+  (via drill 0.6 pad 1.27)
  Top 0.61: U1.4 v62.87,15.27
  Bottom 0.61: v62.87,15.27 C1.1 | C1.1 C3.1 C2.1 61.18,19.22 U4.5 | C1.1 61.18,14.85 60.33,14 59.69,14 57.57,11.88 R15.1 57.47,11.36 Q3.1 57.11,10.19 47.63,10.19 | R14.2 45.82,7.34 Q4.1 47.31,7.34 47.63,7.65 47.63,10.19 | 47.63,10.19 R1.2
VBAT  (via drill 0.6 pad 1.27)
  Top 0.5: R27.1 59.21,50.05 U$5.1 59.38,47.12 U$7.2 | 59.06,53.06 58.93,53.19 C25.1 57.2,53.05 56.52,53.05 55.88,53.69 v55.88,56.86
  Top 0.61: U11.1 59.06,53.06 59.06,51.92 R27.1
  Bottom 0.5: U10.3 56.83,57.81 v55.88,56.86
VCC  (via drill 0.6 pad 1.27)  (1 unrouted)
  Top 0.5: 49.22,45.75 U8.8 48.23,47.84 R25.1 | 49.22,45.75 48.58,45.12 47.53,45.12 R20.1 | 49.22,45.75 50.14,44.83 C23.1 55.6,44.83 55.89,45.12 55.89,46.03 R24.1 | U11.5 59.06,57.17 C26.1 | C26.1 | v53.03,55.28 53.03,56.87 55.72,59.56 | 55.72,59.56 v56.2,60.04 | C26.1 58.1,57.19 55.72,59.56
  Bottom 0.25: U9.5 50.72,61.4 51.22,61.4 U9.6 51.22,59.65 51.47,59.4 U9.9 52.72,59.4 52.72,58.9 U9.10
  Bottom 0.5: IC1.1 53.39,53.86 C22.1 53.24,55.06 v53.03,55.28 | 52.72,59.4 52.72,59.41 53.66,60.36 53.91,60.36 C28.1 56.01,59.85 v56.2,60.04